# Altium schematic sheet Master.SchDoc
size A4; SheetNumber: 3; SheetTotal: 5
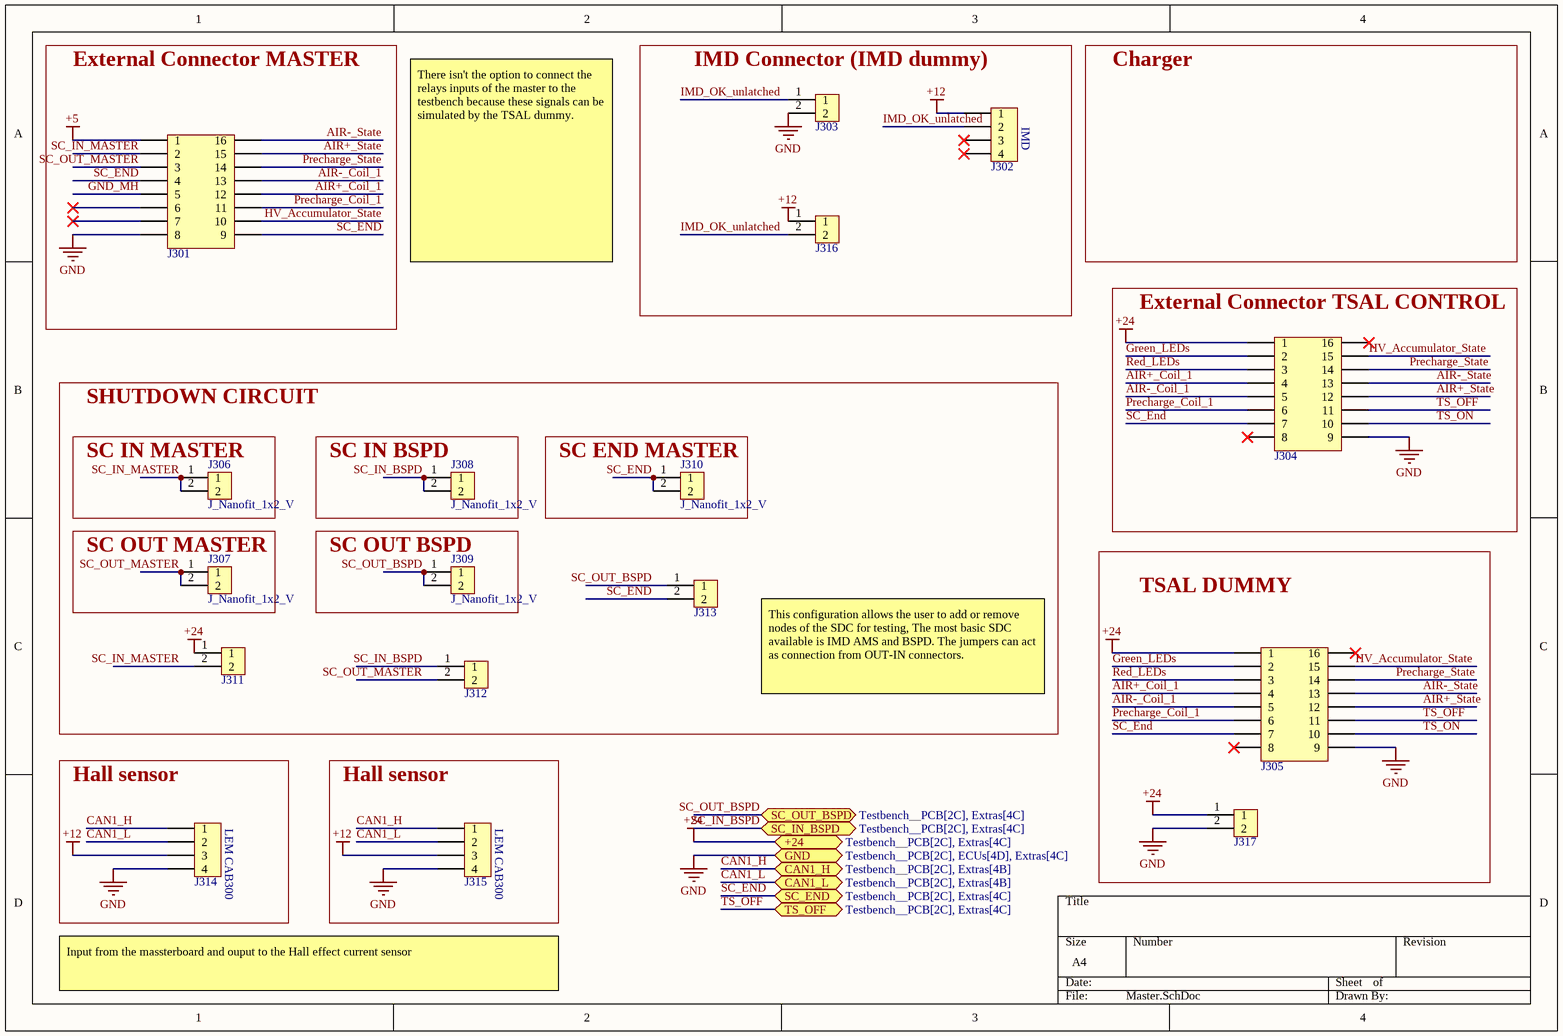
[diagram p0: Master.SchDoc]

## Parts
J301  1053101116  [J_NanoFit_2x8_V]  (value not drawn)
J302  1053091204  [J_NanoFit_1x4_V]  (value not drawn)
J303  61300211121  [J_Pinheader_1x2]  (value not drawn)
J304  1053101116  [J_NanoFit_2x8_V]  (value not drawn)
J305  1053101116  [J_NanoFit_2x8_V]  (value not drawn)
J306  J_Nanofit_1x2_V  [J_NanoFit_1X2_V]
J307  J_Nanofit_1x2_V  [J_NanoFit_1X2_V]
J308  J_Nanofit_1x2_V  [J_NanoFit_1X2_V]
J309  J_Nanofit_1x2_V  [J_NanoFit_1X2_V]
J310  J_Nanofit_1x2_V  [J_NanoFit_1X2_V]
J311  61300211121  [J_Pinheader_1x2]  (value not drawn)
J312  61300211121  [J_Pinheader_1x2]  (value not drawn)
J313  61300211121  [J_Pinheader_1x2]  (value not drawn)
J314  1053091204  [J_NanoFit_1x4_V]  (value not drawn)
J315  1053091204  [J_NanoFit_1x4_V]  (value not drawn)
J316  61300211121  [J_Pinheader_1x2]  (value not drawn)
J317  436500215  [J_MicroFit_2x1]  (value not drawn)

## Blocks framed on the sheet
External Connector MASTER: J301
IMD Connector (IMD dummy): J302 J303 J316
External Connector TSAL CONTROL: J304
SHUTDOWN CIRCUIT: J311-J313
SC IN MASTER: J306
SC IN BSPD: J308
SC END MASTER: J310
SC OUT MASTER: J307
SC OUT BSPD: J309
TSAL DUMMY: J305 J317
Hall sensor: J314
Hall sensor: J315

## Ports
+24 (bidir, see Testbench__PCB[2C], Extras[4C]), CAN1_H (bidir, see Testbench__PCB[2C], Extras[4B]), CAN1_L (bidir, see Testbench__PCB[2C], Extras[4B]), GND (bidir, see Testbench__PCB[2C], ECUs[4D], Extras[4C]), SC_END (bidir, see Testbench__PCB[2C], Extras[4C]), SC_IN_BSPD (bidir, see Testbench__PCB[2C], Extras[4C]), SC_OUT_BSPD (bidir, see Testbench__PCB[2C], Extras[4C]), TS_OFF (bidir, see Testbench__PCB[2C], Extras[4C])

## Nets
+5: J301.1
+12: J302.1 J314.3 J315.3 J316.1
+24: J304.1 J305.1 J311.1 J317.1 ; port +24
GND: J301.8 J303.2 J304.9 J305.9 J314.4 J315.4 J317.2 ; port GND
AIR+_Coil_1: J301.12 J304.4 J305.4
AIR+_State: J301.15 J304.12 J305.12
AIR-_Coil_1: J301.13 J304.5 J305.5
AIR-_State: J301.16 J304.13 J305.13
CAN1_H: J314.1 J315.1 ; port CAN1_H
CAN1_L: J314.2 J315.2 ; port CAN1_L
GND_MH: J301.5
Green_LEDs: J304.2 J305.2
HV_Accumulator_State: J301.10 J304.15 J305.15
IMD_OK_unlatched: J302.2 J303.1 J316.2
Precharge_Coil_1: J301.11 J304.6 J305.6
Precharge_State: J301.14 J304.14 J305.14
Red_LEDs: J304.3 J305.3
SC_END: J301.4 J301.9 J304.7 J305.7 J310.1 J310.2 J313.2 ; port SC_END
SC_IN_BSPD: J308.1 J308.2 J312.1 ; port SC_IN_BSPD
SC_IN_MASTER: J301.2 J306.1 J306.2 J311.2
SC_OUT_BSPD: J309.1 J309.2 J313.1 ; port SC_OUT_BSPD
SC_OUT_MASTER: J301.3 J307.1 J307.2 J312.2
TS_OFF: J304.11 J305.11 ; port TS_OFF
TS_ON: J304.10 J305.10

Not connected (* = marked no-connect by the designer): J301 6* 7*; J302 3* 4*; J304 8* 16*; J305 8* 16*

## Notes on the sheet
- Charger
- (near J302) IMD
- There isn't the option to connect the relays inputs of the master to the testbench because these signals can be simulated by the TSAL dummy.
- This configuration allows the user to add or remove nodes of the SDC for testing, The most basic SDC available is IMD AMS and BSPD. The jumpers can act as connection from OUT-IN connectors.
- (near J314) LEM CAB300
- (near J315) LEM CAB300
- Input from the massterboard and ouput to the Hall effect current sensor

## Library data of the parts
J301 J304 J305 = J_NanoFit_2x8_V: Nano-Fit Vertical Header Through Hole 2.50mm Pitch Dual Row 16 Circuits with Kinked Pins Tin (Sn) Plating Black; Manufacturer 1: Molex; Manufacturer Part Number 1: 105310-1116; Connector Type: Header,Male Pin; Number of Positions: 16; .Creator: AC; Supplier 1: Digi-Key; RoHS: No; Category: Headers and Wire Housings; Stock 1: 84; Pricing 1: 1=3,21000, 10=2,82400, 84=2,24619, 1008=1,86110, 4956=1,66858 (USD); Mount: Through Hole; Contact Plating: Tin; Contact Material: Brass; Contact Shape: Square; Insulation Material: Polymer; Insulation Color: Black; Min Operating Temperature: -40°C; Max Operating Temperature: 105°C; Fastening Type: Latch; Packaging: Tray; Number of Rows: 2; Termination: Kinked Pin; ComponentLink1URL: https://www.molex.com/pdm_docs/sd/1053101210_sd.pdf?src-supplier=Digi-Key; ComponentLink1Description: https://www.molex.com/pdm_docs/sd/1053101210_sd.pdf?src-supplier=Digi-Key; Supplier Part Number 1: WM16885-ND; ComponentLink2Description: Molex; ComponentLink2URL: https://www.molex.com/molex/products/part-detail/pcb_headers/1053101116
J302 J314 J315 = J_NanoFit_1x4_V: Nano-Fit Vertical Header Through Hole 2.50mm Pitch Single Row 4 Circuits with Kinked Pins 0.38; Manufacturer 1: Molex; Manufacturer Part Number 1: 105309-1204; .Creator: DO; Supplier 1: Arrow Electronics; RoHS: No; Category: Headers and Wire Housings; Stock 1: 709; Pricing 1: 1=1,37050, 10=1,11700, 100=0,95270, 500=0,86980, 1000=0,74060, 2500=0,71930, 5000=0,68450, 10000=0,66860 (USD); ComponentLink1URL: http://farnell.com//datasheets/2221349.pdf?src-supplier=Farnell; ComponentLink1Description: http://farnell.com//datasheets/2221349.pdf?src-supplier=Farnell; ComponentLink2URL: http://www.farnell.com/datasheets/2221349.pdf?src-supplier=Newark; ComponentLink2Description: http://www.farnell.com/datasheets/2221349.pdf?src-supplier=Newark; ComponentLink3URL: http://www.literature.molex.com/SQLImages/kelmscott/Molex/PDF_Images/987651-1223.PDF?src-supplier=Digi-Key; ComponentLink3Description: http://www.literature.molex.com/SQLImages/kelmscott/Molex/PDF_Images/987651-1223.PDF?src-supplier=Digi-Key; ComponentLink4URL: http://www.farnell.com/datasheets/2059602.pdf?src-supplier=Element14; ComponentLink4Description: http://www.farnell.com/datasheets/2059602.pdf?src-supplier=Element14; Supplier Part Number 1: 105309-1204
J303 J311-J313 J316 = J_Jumper: CONN HEADER 2 POS 2.54; Manufacturer: Molex; Temperature rating: -40° to +105°C; Category type: PCB-PCB; Product name: Pin Header; Maximum current: 3 A; Maximum voltage: 250 V AC; Connections: 1x2; Current Rating: 3A; Voltage Rating: 250V; Number of Positions: 2; Gender: Male; Connector Type: Male Pin; Pitch: 0.1inch; .Creator: GP; Category: Connector; ComponentLink1Description: Datasheet; ComponentLink1URL: https://www.we-online.com/catalog/datasheet/61300211121.pdf; ComponentLink2Description: Where buy it; ComponentLink2URL: https://www.we-online.com/catalog/en/PHD_2_54_THT_PIN_HEADER_6130XX11121?sq=61300211121&sp=https%3A%2F%2Fwww.we-online.com%2Fweb%2Fen%2Fwuerth_elektronik%2Fsearchpage.php%3Fsearch%3D61300211121#61300211121; Manufacturer part number: 61300211121; Supplier: Würth Elektronik; RoHS: *; Application: Shortcircuit; Flammability: 94V-0; Orientation: Vertical; Mount: Through hole; Supplier 1: RSComponents; Stock 1: 1855; Pricing 1: 5=0,14100, 50=0,09700, 100=0,07800, 200=0,07300, 500=0,06800 (USD); Contact Plating: Gold; Housing Material: PBT; Contact Material: Copper Alloy,Copper; Color: Black; Min Operating Temperature: -40°C; Max Operating Temperature: 125°C; Number of Rows: 1; Contact Gender: Male; Packaging: Bulk; Termination: Through Hole; Number of Contacts: 2; Contact Mating Length: 0.236inch; REACH SVHC: Unknown; Lead Free: Lead Free; ComponentLink3URL: https://datasheet.ciiva.com/13619/6130xx11121-48870-13619345.pdf?src-supplier=Mouser; ComponentLink3Description: https://datasheet.ciiva.com/13619/6130xx11121-48870-13619345.pdf?src-supplier=Mouser; Supplier Part Number 1: 8281581
J306-J310 = J_Nanofit_1x2_V: Nano-Fit Vertical Header, Through Hole, 2.50mm Pitch, Single Row, 2 Circuits, with Kinked Pins, Tin (Sn) Plating,...; Manufacturer: Molex; Manufacturer Part Number: 1053092202; Supplier 1: Mouser; RoHS: No; Stock 1: 6299; Pricing 1: 1=1,09, 10=0,839, 50=0,839, 100=0,686, 1000=0,571, 10000=0,507 (USD); Supplier Part Number 1: 538-105309-2202
J317 = J_MicroFit_2x1: Header 1 Row Vertical Polarizing Peg 2 Pin SMT/Glow Wire Compatible Tin Plate; Manufacturer 1: Molex; Manufacturer Part Number 1: 43650-0215; Supplier 1: Arrow Electronics; RoHS: Yes; Category: Headers and Wire Housings; Stock 1: 11086; Pricing 1: 1=0,87800, 10=0,74400, 80=0,63070, 3264=0,47000, 6528=0,45100, 13056=0,41760 (USD); ComponentLink1URL: https://datasheet.ciiva.com/19462/884109-19462034.pdf?src-supplier=Jameco; ComponentLink1Description: https://datasheet.ciiva.com/19462/884109-19462034.pdf?src-supplier=Jameco; ComponentLink2URL: https://datasheet.ciiva.com/5157/0436500215-pcb-headers-148687-5157608.pdf?src-supplier=Mouser; ComponentLink2Description: https://datasheet.ciiva.com/5157/0436500215-pcb-headers-148687-5157608.pdf?src-supplier=Mouser; ComponentLink3URL: https://datasheet.ciiva.com/16085/0436500215-pcb-headers-16085668.pdf?src-supplier=Onlinecomponents.com; ComponentLink3Description: https://datasheet.ciiva.com/16085/0436500215-pcb-headers-16085668.pdf?src-supplier=Onlinecomponents.com; ComponentLink4URL: https://datasheet.ciiva.com/11748/0900766b80307ce2-11748388.pdf?src-supplier=RSComponents; ComponentLink4Description: https://datasheet.ciiva.com/11748/0900766b80307ce2-11748388.pdf?src-supplier=RSComponents; ComponentLink5URL: https://datasheet.ciiva.com/9432/0436500215-pcb-headers-9432850.pdf?src-supplier=Avnet; ComponentLink5Description: https://datasheet.ciiva.com/9432/0436500215-pcb-headers-9432850.pdf?src-supplier=Avnet; ComponentLink6URL: https://datasheet.ciiva.com/7920/1889390-7920892.pdf?src-supplier=Element14; ComponentLink6Description: https://datasheet.ciiva.com/7920/1889390-7920892.pdf?src-supplier=Element14; Supplier Part Number 1: 43650-0215